# EAGLE design TTL_Inverter (EAGLE 7.6.0)
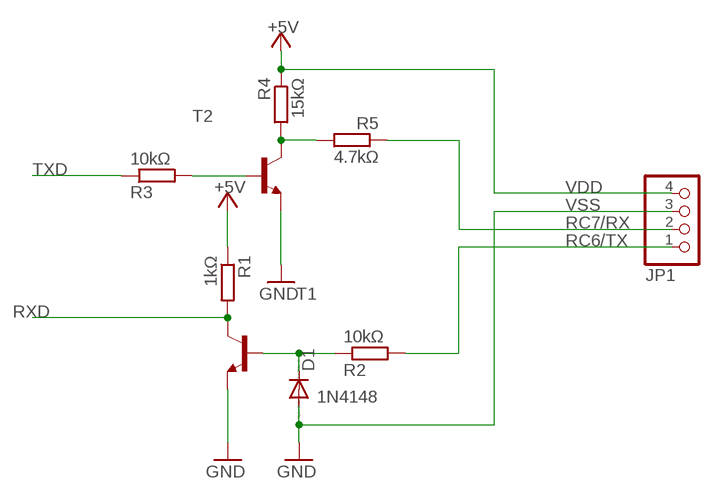
[diagram p0: schematic, sheet 1]

## Parts
D1  1N4148  1N4148DO35-7  [DO35-7]
JP1  PINHD-1X4  [1X04]
R1  1kΩ  R-EU_0207/2V  [0207/2V]
R2  10kΩ  R-EU_0207/7  [0207/7]
R3  10kΩ  R-EU_0207/10  [0207/10]
R4  15kΩ  R-EU_0207/10  [0207/10]
R5  4.7kΩ  R-EU_0207/2V  [0207/2V]
T1  BC547-NPN-TO92-CBE  [TO92-CBE]
T2  BC547-NPN-TO92-CBE  [TO92-CBE]

## Nets
GND: T1.E T2.E
N$1: R3.2 T2.B
N$2: R4.2 R5.2 T2.C
N$4: D1.C R2.1 T1.B
RC6/TX: JP1.1 R2.2
RC7/RX: JP1.2 R5.1
RXD: R1.2 T1.C
TXD: R3.1
VDD: JP1.4 R1.1 R4.1 ; supply symbol labelled +5V
VSS: D1.A JP1.3 ; supply symbol labelled GND

## Library data of the parts
D1 = diode:1N4148: DIODE high speed (Philips)
JP1 = pinhead:PINHD-1X4: PIN HEADER
R1-R5 = resistor:R-EU_: RESISTOR, European symbol
T1 T2 = transistor:*-NPN-: NPN Transistror BF959 corrected 2008.03.06

## Board
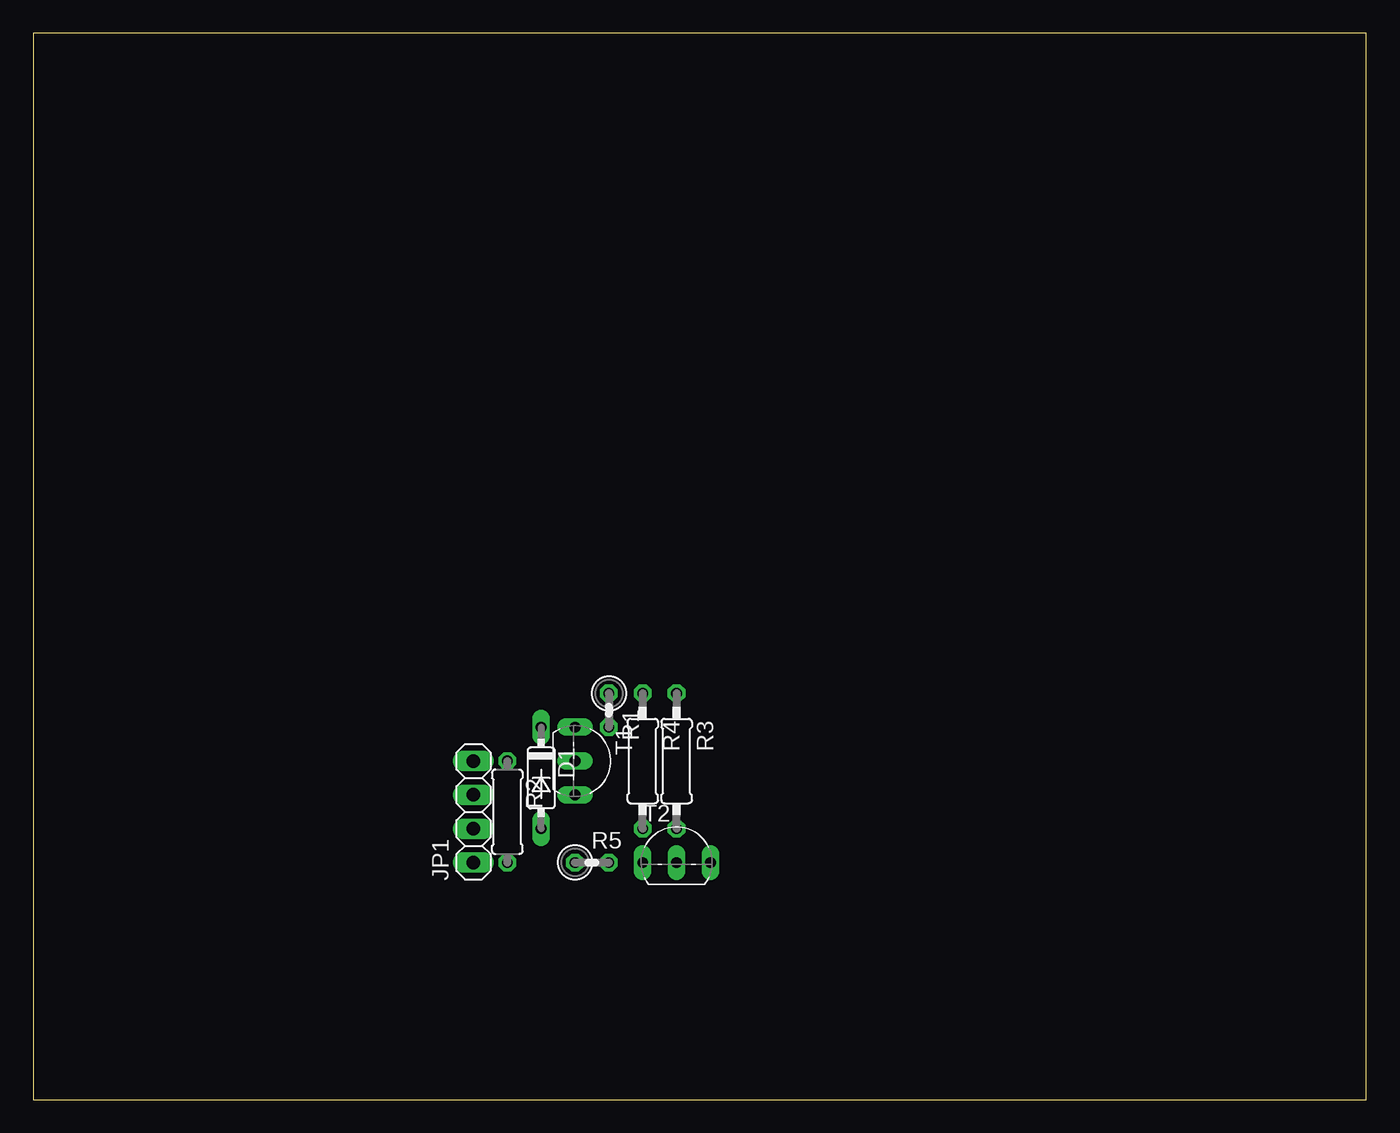
[diagram p1: board, top side]
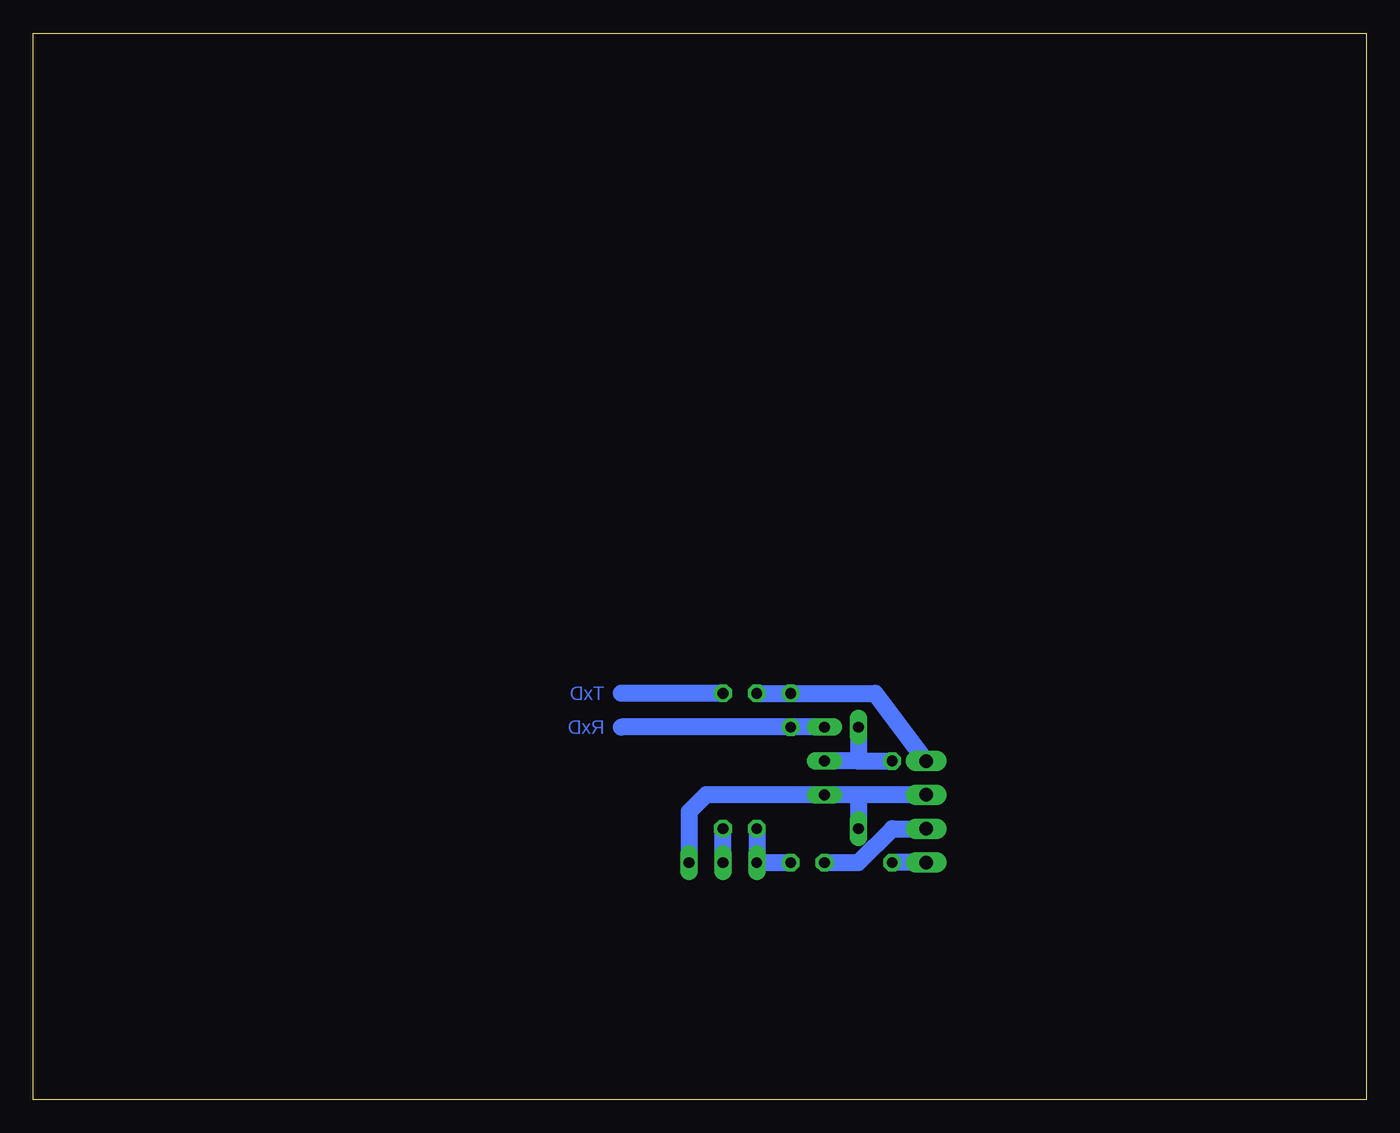
[diagram p2: board, bottom side, seen from below]

Size 100 x 80 mm. Coordinates in mm from the lower left corner, seen from the top.
Outline: 0,0 100,0 100,80 0,80 0,0
Copper layers (1*16): Top 0.035mm / dielectric 1.5mm / Bottom 0.035mm
Design rules "default": minimum track width 10mil, minimum drill 24mil, track to track 8mil, track to pad 8mil, pad to pad 8mil, via to via 8mil, smd to smd 8mil, copper to edge 40mil, drill to drill 8mil, minimum pad ring 10mil, minimum via ring 8mil, stop-mask expansion 4mil, vias tented up to drill 0mil, thermal gap 10mil

### Footprints (pad centres in the part's own frame; a part is rotated, then mirrored left to right if it is on the bottom)
DO35-7 = drill 0.813 long: A 3.81,0; C -3.81,0
1X04 = drill 1.016 long: 1 -3.81,0; 2 -1.27,0; 3 1.27,0; 4 3.81,0
0207/2V = drill 0.813 octagon: 1 -1.27,0; 2 1.27,0
0207/7 = drill 0.813 octagon: 1 -3.81,0; 2 3.81,0
0207/10 = drill 0.813 octagon: 1 -5.08,0; 2 5.08,0
TO92-CBE = drill 0.813 long: B 0,0; C -2.54,0; E 2.54,0

### Placement (x,y rotation side)
D1  38.1,24.13 270 top
JP1  33.02,21.59 90 top
R1  43.18,29.21 270 top
R2  35.56,21.59 270 top
R3  48.26,25.4 270 top
R4  45.72,25.4 270 top
R5  41.91,17.78 0 top
T1  40.64,25.4 270 top
T2  48.26,17.78 0 top

### Tracks (layer width: path | path; a pad name or v marks a point on that pad's centre or on a via)
GND
  Bottom 1.27: 38.1,22.86 T1.E 49.53,22.86 50.8,21.59 T2.E
N$1
  Bottom 1.27: T2.B R3.2
N$2
  Bottom 1.27: R4.2 T2.C R5.2
N$4
  Bottom 1.27: 38.1,25.4 T1.B | D1.C 38.1,25.4 | 38.1,25.4 R2.1
RC6/TX
  Bottom 1.27: JP1.1 R2.2
RC7/RX
  Bottom 1.27: R5.1 38.1,17.78 35.56,20.32 JP1.2
RXD
  Bottom 1.27: T1.C R1.2 55.88,27.94
TXD
  Bottom 1.27: R3.1 55.88,30.48
VDD
  Bottom 1.27: JP1.4 36.83,30.48 R1.1 R4.1
VSS
  Bottom 1.27: JP1.3 38.1,22.86 D1.A

### Text on the board
Bottom: TxD | RxD